# Altium schematic sheet HydrophoneGroup3FilterAndAmpCircuit.SchDoc
size C
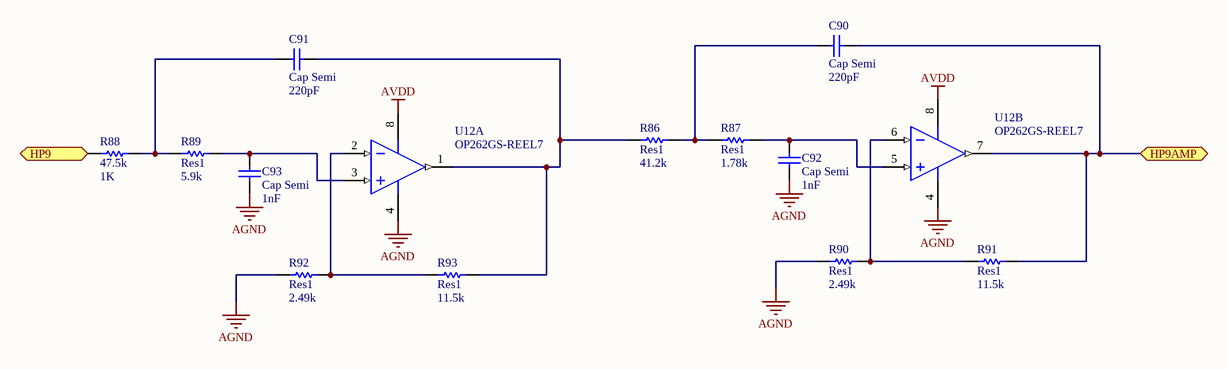
[diagram p0: HydrophoneGroup3FilterAndAmpCircuit.SchDoc]

## Parts
C90  Cap Semi  value 220pF  [0402]
C91  Cap Semi  value 220pF  [0402]
C92  Cap Semi  value 1nF  [0402]
C93  Cap Semi  value 1nF  [0402]
R86  Res1  value 41.2k  [AXIAL-0.3]
R87  Res1  value 1.78k  [AXIAL-0.3]
R88  47.5k  value 1K  [AXIAL-0.3]
R89  Res1  value 5.9k  [AXIAL-0.3]
R90  Res1  value 2.49k  [AXIAL-0.3]
R91  Res1  value 11.5k  [AXIAL-0.3]
R92  Res1  value 2.49k  [AXIAL-0.3]
R93  Res1  value 11.5k  [AXIAL-0.3]
U12  OP262GS-REEL7  [ADI-R-8_L]  (parts A,B of 2)

## Ports
HP9, HP9AMP

## Nets
AGND: C92.1 C93.1 R90.1 R92.1 U12.4(-V)
AVDD: U12.8(+V)
HP9: R88.1 ; port HP9
HP9AMP: C90.2 R91.2 U12.7(OUT_B) ; port HP9AMP
NetC90_1: C90.1 R86.2 R87.1
NetC91_1: C91.1 R88.2 R89.1
NetC91_2: C91.2 R86.1 R93.2 U12.1(OUT_A)
NetC92_2: C92.2 R87.2 U12.5(+IN_B)
NetC93_2: C93.2 R89.2 U12.3(+IN_A)
NetR90_2: R90.2 R91.1 U12.6(-IN_B)
NetR92_2: R92.2 R93.1 U12.2(-IN_A)

## Library data of the parts
C90-C93 = Cap Semi: Capacitor (Semiconductor SIM Model); Published: 8-Jun-2000; LatestRevisionDate: 29-May-2009; LatestRevisionNote: IPC-7351 Footprint Added.; PackageReference: C1206; Publisher: Altium Limited; PackageDescription: Chip Capacitor
R86-R93 = Res1: Resistor; Published: 8-Jun-2000; LatestRevisionDate: 17-Jul-2002; LatestRevisionNote: Re-released for DXP Platform.; PackageReference: AXIAL-0.3; Publisher: Altium Limited; PackageDescription: Axial Device, Thru-Hole; 2 Leads; 0.3 in Pin Spacing
U12 = CMP-0384-01031-1: Double Channel Wide Bandwidth Operational Amplifier, 15 MHz BW, 13 V/us SR, Industrial, 8-pin SOIC (R-8), Reel; Generic Part Number: OP262; Manufacturer: Analog Devices; Input Bias Current: 260nA; V Span Min: 2.7V; Iq/Amp: 775uA; Input Offset Voltage: 25uV; Slew Rate: 13V/us; Small Signal Bandwidth: 15MHz; Amplifiers Per Package: 2; V Span Max: 12V; ComponentLink2Description: Datasheet; PackageReference: R-8; ComponentLink3URL: http://www.analog.com/static/imported-files/packages/PKG_PDF/SOIC_Narrow%20(R)/R_8.pdf; PackageVersion: 060506-A; ComponentLink1URL: http://www.analog.com/en/index.html; Mounting Technology: Surface Mount; DatasheetVersion: Rev. G; PackageDescription: 8-Pin Standard Small Outline Package, Body 3.9 x 4.9 mm, Pitch 1.27 mm; ComponentLink2URL: http://www.analog.com/static/imported-files/data_sheets/OP162_262_462.pdf; ComponentLink1Description: Manufacturer URL; Code_JEDEC: MS-012-AA; Packing: Reel; ComponentLink3Description: Package Specification; PartNumber: OP262GS-REEL7; PartId: 1